# Altium schematic sheet RSX11_SDCard.SchDoc
size A
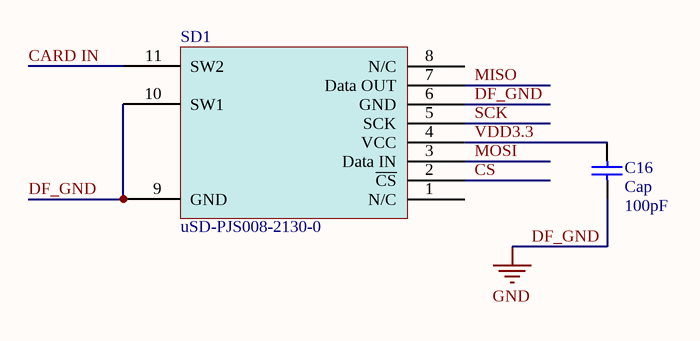
[diagram p0: RSX11_SDCard.SchDoc]

## Parts
C16  Cap  value 100pF  [C1206]
SD1  uSD-PJS008-2130-0  [microSD_push-push]

## Nets
DF_GND: C16.2 SD1.6(GND) SD1.9(GND) SD1.10(SW1)  [also labelled GND]
CARD IN: SD1.11(SW2)
CS: SD1.2(~{CS})
MISO: SD1.7(Data_OUT)
MOSI: SD1.3(Data_IN)
SCK: SD1.5(SCK)
VDD3.3: C16.1 SD1.4(VCC)

Not connected (* = marked no-connect by the designer): SD1 1(N/C) 8(N/C)

## Library data of the parts
C16 = Cap: Capacitor; Published: 8-Jun-2000; LatestRevisionDate: 17-Jul-2002; LatestRevisionNote: Re-released for DXP Platform.; PackageReference: RAD-0.3; Publisher: Altium Limited
SD1 = microSD_card_push-push: RockOn 2016 SD card midification (part number PJS008-2130-0) -Jesse Austin